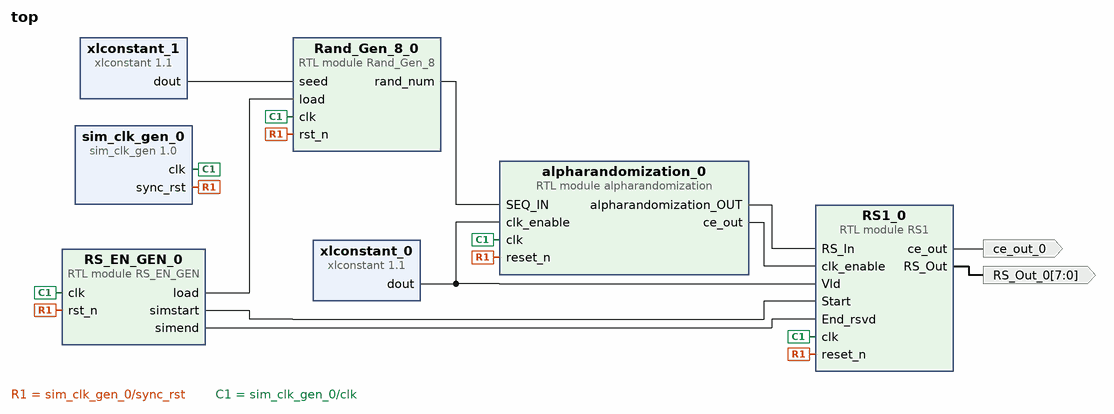
[diagram p0: block diagram of the top level]
# Vivado block design top, xc7z020clg400-3, Vivado 2018.3
create_bd_design top

create_bd_port -dir O -from 7 -to 0 RS_Out_0
create_bd_port -dir O ce_out_0

create_bd_cell -type ip -vlnv xilinx.com:ip:sim_clk_gen:1.0 sim_clk_gen_0
set_property -dict [list \
  CONFIG.FREQ_HZ 100000000 \
  CONFIG.INITIAL_RESET_CLOCK_CYCLES 1000 \
  CONFIG.RESET_POLARITY ACTIVE_LOW \
] [get_bd_cells sim_clk_gen_0]
create_bd_cell -type ip -vlnv xilinx.com:ip:xlconstant:1.1 xlconstant_0
create_bd_cell -type module -reference alpharandomization alpharandomization_0
create_bd_cell -type module -reference RS1 RS1_0
create_bd_cell -type ip -vlnv xilinx.com:ip:xlconstant:1.1 xlconstant_1
set_property -dict {CONFIG.CONST_VAL 149 CONFIG.CONST_WIDTH 8} [get_bd_cells xlconstant_1]
create_bd_cell -type module -reference Rand_Gen_8 Rand_Gen_8_0
create_bd_cell -type module -reference RS_EN_GEN RS_EN_GEN_0

# ---- connections ----

connect_bd_net [get_bd_pins sim_clk_gen_0/sync_rst] \
  [get_bd_pins alpharandomization_0/reset_n] [get_bd_pins RS1_0/reset_n] [get_bd_pins Rand_Gen_8_0/rst_n] \
  [get_bd_pins RS_EN_GEN_0/rst_n]
connect_bd_net [get_bd_pins sim_clk_gen_0/clk] \
  [get_bd_pins alpharandomization_0/clk] [get_bd_pins RS1_0/clk] [get_bd_pins Rand_Gen_8_0/clk] [get_bd_pins RS_EN_GEN_0/clk]
connect_bd_net [get_bd_pins xlconstant_0/dout] [get_bd_pins alpharandomization_0/clk_enable] [get_bd_pins RS1_0/Vld]
connect_bd_net [get_bd_pins RS_EN_GEN_0/simstart] [get_bd_pins RS1_0/Start]
connect_bd_net [get_bd_pins RS_EN_GEN_0/simend] [get_bd_pins RS1_0/End_rsvd]
connect_bd_net [get_bd_pins alpharandomization_0/alpharandomization_OUT] [get_bd_pins RS1_0/RS_In]
connect_bd_net [get_bd_pins alpharandomization_0/ce_out] [get_bd_pins RS1_0/clk_enable]
connect_bd_net [get_bd_pins RS1_0/RS_Out] [get_bd_ports RS_Out_0]
connect_bd_net [get_bd_pins RS1_0/ce_out] [get_bd_ports ce_out_0]
connect_bd_net [get_bd_pins Rand_Gen_8_0/rand_num] [get_bd_pins alpharandomization_0/SEQ_IN]
connect_bd_net [get_bd_pins xlconstant_1/dout] [get_bd_pins Rand_Gen_8_0/seed]
connect_bd_net [get_bd_pins RS_EN_GEN_0/load] [get_bd_pins Rand_Gen_8_0/load]

validate_bd_design
save_bd_design
